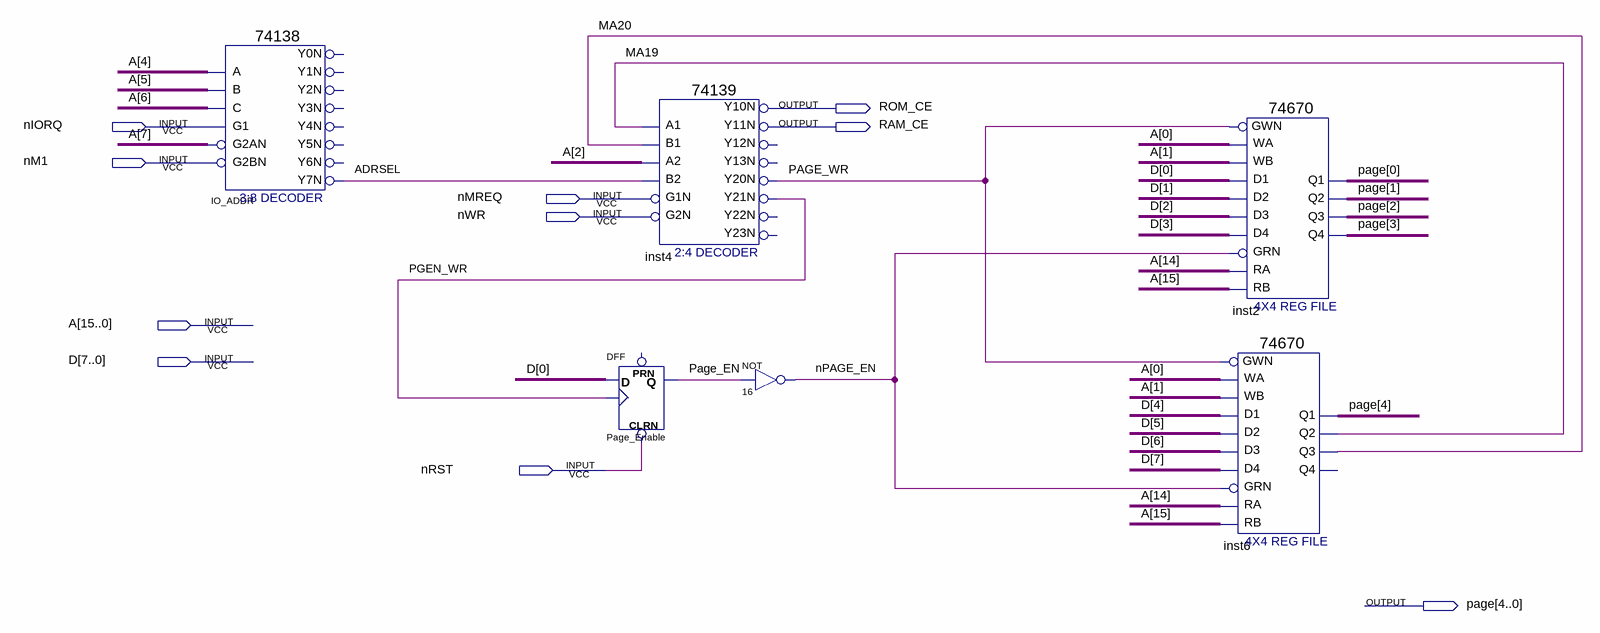
[diagram p0: schematic sheet]
// Quartus schematic ram_rom_page.bdf as structural Verilog: 6 symbols, 10 pins
module ram_rom_page (
  input  nIORQ,
  input  nM1,
  input  nMREQ,
  input  nWR,
  input  [15:0] A,
  input  [7:0] D,
  input  nRST,
  output ROM_CE,
  output RAM_CE,
  output [4:0] page
);

  wire ADRSEL, MA19, MA20, nPAGE_EN, Page_EN, PAGE_WR, PGEN_WR;

  \74138  IO_ADDR (
    .A(A[4]), .B(A[5]), .G1(nIORQ), .C(A[6]), .G2AN(A[7]), .G2BN(nM1), .Y7N(ADRSEL));  // open: Y0N, Y1N, Y2N, Y3N, Y4N, Y5N, Y6N
  DFF Page_Enable (.CLRN(nRST), .CLK(PGEN_WR), .D(D[0]), .Q(Page_EN));  // open: PRN
  \74139  inst4 (
    .A1(MA19), .A2(A[2]), .B1(MA20), .B2(ADRSEL), .G1N(nMREQ), .G2N(nWR), .Y10N(ROM_CE), .Y20N(PAGE_WR),
    .Y11N(RAM_CE), .Y21N(PGEN_WR));  // open: Y13N, Y12N, Y22N, Y23N
  not u_16 (nPAGE_EN, Page_EN);
  \74670  inst2 (
    .WA(A[0]), .D1(D[0]), .WB(A[1]), .D2(D[1]), .GRN(nPAGE_EN), .D4(D[3]), .D3(D[2]), .RA(A[14]), .RB(A[15]),
    .GWN(PAGE_WR), .Q3(page[2]), .Q4(page[3]), .Q1(page[0]), .Q2(page[1]));
  \74670  inst6 (
    .WA(A[0]), .D1(D[4]), .WB(A[1]), .D2(D[5]), .GRN(nPAGE_EN), .D4(D[7]), .D3(D[6]), .RA(A[14]), .RB(A[15]),
    .GWN(PAGE_WR), .Q3(MA20), .Q1(page[4]), .Q2(MA19));  // open: Q4
endmodule
